# Altium schematic sheet Controller_Hardware_SDR_sch.SchDoc
size A4; SheetNumber: 5; SheetTotal: 5
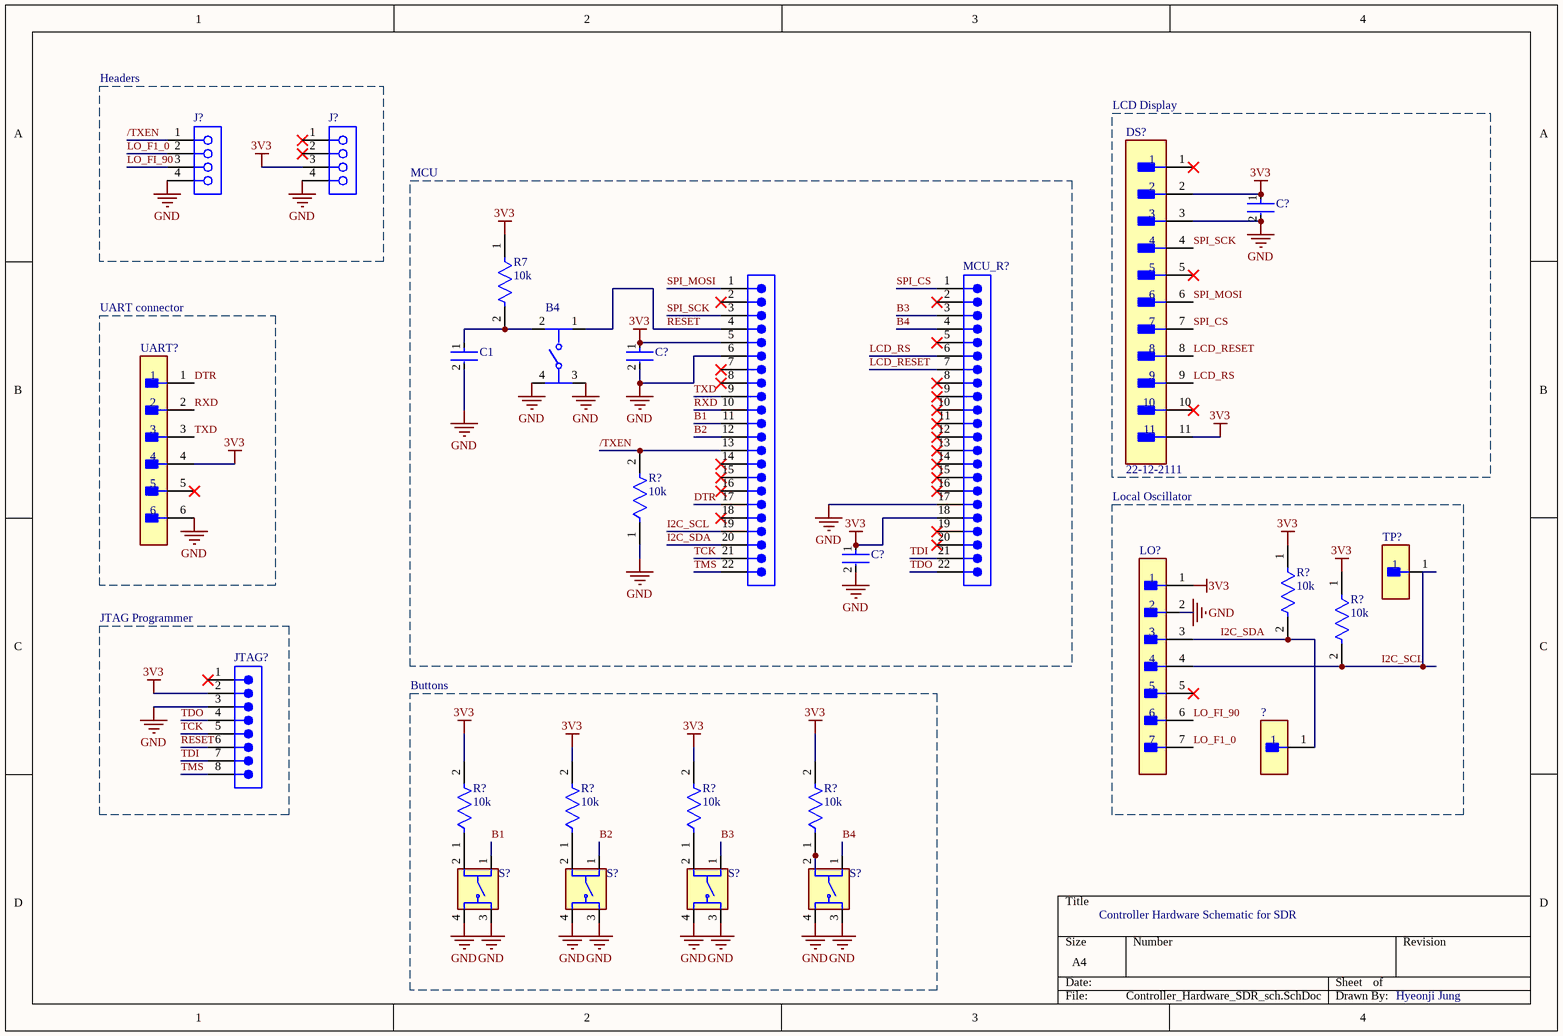
[diagram p0: Controller_Hardware_SDR_sch.SchDoc]

## Parts
(Parts that share a designator on the sheet are numbered #1, #2 ... from top to bottom, then left to right.)
?#1  (no value)  [61302211121]
?#2  5015  [FP-5015-MFG]  (value not drawn)
B4  FSM103  [FP-FSM103-MFG]  (value not drawn)
C1  100nF  [FP-0805-L_2_01_0_2-W_1_25-IPC_B]  (value not drawn)
C?#1  08051C104K4T2A  [FP-0805-L_2_01_0_2-W_1_25-IPC_B]  (value not drawn)
C?#2  08051C104K4T2A  [FP-0805-L_2_01_0_2-W_1_25-IPC_B]  (value not drawn)
C?#3  08051C104K4T2A  [FP-0805-L_2_01_0_2-W_1_25-IPC_B]  (value not drawn)
DS?  22-12-2111  [FP-22-12-2111-MFG]
J?#1  61300411821  [61300411821]  (value not drawn)
J?#2  61300411821  [61300411821]  (value not drawn)
JTAG?  61300811121  [61300811121]  (value not drawn)
LO?  70543-0006  [FP-70543-0006-MFG]  (value not drawn)
MCU_R?  61302211121  [61302211121]  (value not drawn)
R7  10k  [FP-MRS25-MFG]
R?#1  10k  [FP-RT0805-MFG]
R?#2  10k  [FP-MRS25-MFG]
R?#3  10k  [FP-MRS25-MFG]
R?#4  10k  [FP-RT0805-MFG]
R?#5  10k  [FP-RT0805-MFG]
R?#6  10k  [FP-RT0805-MFG]
R?#7  10k  [FP-RT0805-MFG]
S?#1  VS-1213-67-160GF  [SW_VS-1213-67-160GF]  (value not drawn)
S?#2  VS-1213-67-160GF  [SW_VS-1213-67-160GF]  (value not drawn)
S?#3  VS-1213-67-160GF  [SW_VS-1213-67-160GF]  (value not drawn)
S?#4  VS-1213-67-160GF  [SW_VS-1213-67-160GF]  (value not drawn)
TP?  0  [FP-5015-MFG]  (value not drawn)
UART?  22-28-4060  [FP-22-28-4060-MFG]  (value not drawn)

## Nets
3V3: ?#1.5 C?#1.1 C?#2.1 C?#3.1 DS?.2 DS?.11 J?#2.3 JTAG?.2 LO?.1 MCU_R?.18 R7.1 R?#2.1 R?#3.1 R?#4.2 R?#5.2 R?#6.2 R?#7.2 UART?.4
GND: ?#1.6 B4.3 B4.4 C1.2 C?#1.2 C?#2.2 C?#3.2 DS?.3 J?#1.4 J?#2.4 JTAG?.3 LO?.2 MCU_R?.17 R?#1.1 S?#1.3 S?#1.4 S?#2.3 S?#2.4 S?#3.3 S?#3.4 S?#4.3 S?#4.4 UART?.6
/TXEN: ?#1.13 J?#1.1 R?#1.2
B1: ?#1.11 S?#1.1
B2: ?#1.12 S?#2.1
B3: MCU_R?.3 S?#3.1
B4: MCU_R?.4 S?#4.1
DTR: ?#1.17 UART?.1
I2C_SCL: ?#1.19 LO?.4 R?#3.2 TP?.1
I2C_SDA: ?#1.20 ?#2.1 LO?.3 R?#2.2
LCD_RESET: DS?.8 MCU_R?.7
LCD_RS: DS?.9 MCU_R?.6
LO_F1_0: J?#1.2 LO?.7
LO_FI_90: J?#1.3 LO?.6
RESET: ?#1.4 B4.1 JTAG?.6
RXD: ?#1.10 UART?.2
SPI_CS: DS?.7 MCU_R?.1
SPI_MOSI: ?#1.1 DS?.6
SPI_SCK: ?#1.3 DS?.4
TCK: ?#1.21 JTAG?.5
TDI: JTAG?.7 MCU_R?.21
TDO: JTAG?.4 MCU_R?.22
TMS: ?#1.22 JTAG?.8
TXD: ?#1.9 UART?.3
NetB4_2: B4.2 C1.1 R7.2
NetR?#4_1: R?#4.1 S?#1.2
NetR?#5_1: R?#5.1 S?#2.2
NetR?#6_1: R?#6.1 S?#3.2
NetR?#7_1: R?#7.1 S?#4.2

Not connected (* = marked no-connect by the designer): ?#1 2* 7* 8* 14* 15* 16* 18*; DS? 1* 5* 10*; J?#2 1* 2*; JTAG? 1*; LO? 5*; MCU_R? 2* 5* 8* 9* 10* 11* 12* 13* 14* 15* 16* 19* 20*; UART? 5*

## Notes on the sheet
- Headers
- LCD Display
- MCU
- UART connector
- Local Oscillator
- JTAG Programmer
- Buttons
- Controller Hardware Schematic for SDR
- Hyeonji Jung

## Library data of the parts
?#1 MCU_R? = CMP-1502-01106-3: NexarPartId: 32855558; Number of Positions: 22; Connector Type: Male Pin; Contact Resistance: 20mΩ; Pitch: 2.54mm; Operating Supply Voltage: 250V; Current Rating: 3A; Gender: Male; Contact Plating: Gold; Number of Pins: 22; Mount: Through Hole; Color: Black; Number of Rows: 1; Contact Material: Copper; Contact Mating Length: 5.9944mm; Lead Pitch: 2.54mm; REACH SVHC: Unknown; Packaging: Bulk; Orientation: Vertical; Termination: Solder; Number of Contacts: 22; RoHS: Compliant
?#2 = CMP-2000-05183-2: PC TEST POINT MINIATURE; Manufacturer: keystone; Number Of Contacts: 1; Conn Orientation: Straight; Category: Conn; Manufacturer Part Number: 5015; Digikey Description: PC TEST POINT MINIATURE; Automotive: No; Lead Free: Yes; Octopart: https://octopart.com/5015-keystone-3822; ComponentLink2URL: http://www.keyelco.com/product-pdf.cfm?p=1353; Package: 5015; RoHS: TRUE; Device Class L3: unset; Device Class L2: unset; Contact Material: Silver; Device Class L1: Connectors; Height: 1.65mm; ComponentLink2Description: Datasheet
B4 = CMP-03407-000037-1: SWITCH TACTILE SPST-NO 0.05A 24V; Contact Resistance: 100mR; Actuator Length: 3.4mm; Switch Function: Off-Mom; Operating Force: 1.57N; Illumination Type: Non-Illuminated; Voltage Rating (DC): 12V; Current Rating: 50mA; Actuator Material: Polyester; Switch Travel: 0.3mm; Throw Configuration: SPST; Actuator Color: Black; Mechanical Life: 100000Cycles; Depth: 14.1mm; RoHS Compliant: Yes; Max Operating Temperature: 85°C; Mount: Through Hole; Min Operating Temperature: -35°C; Contact Plating: Silver; Width: 12mm; Package Quantity: 400; Radiation Hardening: No; Series: FSM100 ~ 104; Type: Switch; Termination: PC Pins; Voltage Rating: 24V; Contact Material: Brass; Max Voltage Rating (DC): 12V; Contact Current Rating: 50mA; Length: 12mm; Packaging: Loose Piece; Orientation: Straight; Max Current Rating: 50mA; Electrical Life: 100000Cycles
C1 C?#1-C?#3 = CMP-2007-04172-2: Automotive Ceramic Capacitor, 0805, 100nF, 10%, X7R, 15%, 100V; Voltage Rating (DC): 100V; Case Code (Metric): 2012; Mount: Surface Mount; Length: 2.01mm; Depth: 1.25mm; Lead Free: Lead Free; Ratings: AEC-Q200; Max Operating Temperature: 125°C; Tolerance: 10%; Case/Package: 0805; Width: 0.049inch; Package Quantity: 1; Thickness: 0.055inch; Construction: Flat; Min Operating Temperature: -55°C; REACH SVHC: No SVHC; Number of Pins: 2; Radiation Hardening: No; Capacitance: 100nF; Voltage Rating: 100V; Height: 1.4mm; Series: -; Voltage: 100V; Dielectric: X7R; Termination: SMD/SMT; Case Code (Imperial): 0805; RoHS Compliant: Yes; Packaging: Tape and Reel; Dielectric Material: Ceramic
DS? = CMP-04776-000920-1: KK 100 HDR FLAT RTAN 11 CKT GOLD; Contact Resistance: 10mR; Number of Contacts: 11; Connector Type: Male Pin; Current Rating: 4A; Voltage Rating: 250V; Color: White; Insulation Resistance: 50GR; Pitch: 2.54mm; Glow Wire Compliant: Non-compliant; Gender: Male; Contact Plating: Gold; Orientation: Right Angle; Radiation Hardening: No; Contact Mating Length: 0.369inch; Mount: Through Hole; Halogen Free: Low Halogen; Lead Free: Contains Lead; Number of Circuits: 11; Contact Type: Male Pin; Number of Positions: 11; Series: KK® 4094; RoHS Compliant: Yes; Termination: Solder; Package Quantity: 10; Packaging: Bulk; Number of Rows: 1; Min Operating Temperature: 0°C; Housing Material: Nylon; Housing Color: White; Voltage Rating (DC): 250V; Flammability Rating: UL94 V-0; Max Operating Temperature: 75°C; Contact Material: Brass
J?#1 J?#2 = CMP-1502-01316-3: NexarPartId: 61924712; Contact Resistance: 20mΩ; Gender: Female; Current Rating: 3A; Operating Supply Voltage: 250V; RoHS: Non-Compliant; Number of Pins: 4; Orientation: Vertical; Lead Pitch: 2.54mm
JTAG? = CMP-1502-01076-3: NexarPartId: 32855533; Connector Type: Male Pin; Number of Contacts: 8; Voltage Rating: 250V; Current Rating: 3A; Contact Resistance: 20mΩ; Pitch: 2.54mm; Gender: Male; Termination: Solder; Contact Material: Copper; Mount: Through Hole; Lead Pitch: 2.54mm; Number of Positions: 8; Operating Supply Voltage: 250V; Number of Pins: 8; Max Operating Temperature: 105°C; Height: 8.54mm; REACH SVHC: Unknown; Number of Rows: 1; Packaging: Bulk; Contact Plating: Gold; Contact Mating Length: 5.9944mm; Orientation: Vertical; RoHS: Compliant; Color: Black; Min Operating Temperature: -40°C
LO? = CMP-04776-000019-1: CONN HEADER VERT 7POS 2.54MM; Manufacturer: Molex; Voltage Rating: 250V; Number Of Contacts: 7; Conn Gender: Male; Standoff Height: 0.25mm; Current Rating: 3A; Conn Orientation: Vertical; Category: Conn; RoHS: TRUE; Contact Material: Gold,Nickel; Device Class L2: Headers and Wire Housings; Octopart: https://octopart.com/70543-0006-molex-277837; Mouser Description: Conn Shrouded Header (4 Sides) HDR 7 POS 2.54mm Solder ST Thru-Hole SL™ Tube; Device Class L1: Connectors; Lead Free: Yes; Temperature Range Low: -40°C; Digikey Description: CONN HEADER VERT 7POS 2.54MM; Number Of Rows: 1; Package: 0; Temperature: -40°C to +105°C; Device Class L3: unset; Height: 12.07mm; Pitch: 2.54mm; Temperature Range High: +105°C; ComponentLink2Description: Datasheet; Automotive: No; Footprint Url: https://www.molex.com/pdm_docs/sd/705430006_sd.pdf; Manufacturer Part Number: 70543-0006; ComponentLink2URL: https://www.molex.com/webdocs/datasheets/pdf/en-us/0705430006_PCB_HEADERS.pdf
R7 R?#2 R?#3 = CMP-00030-42632392-1: MRS25000C1002FCT00 Resistor, 10 kOhm, ± 1%, 600 mW, Axial Leaded, Metal Film (Thin Film), Professional; Power Rating: 600mW; Voltage Rating (DC): 350V; Lead Length: 26mm; Resistance: 10kΩ; Temperature Coefficient: 50ppm/°C; Termination: Axial; Number of Terminations: 2; Diameter: 2.5mm; Composition: Metal Film, Thin Film; Number of Pins: 2; Length: 6.5mm; Military Standard: Not; RoHS: Compliant; NexarPartId: 42632392; Width: 2.5mm; Radiation Hardening: No; Voltage Rating: 350V; Max Power Dissipation: 600mW; Min Operating Temperature: -55°C; Lead Free: Lead Free; Max Operating Temperature: 155°C; Tolerance: 1%; Schedule B: 8533210090, 8533210090; Contact Plating: Tin; Mount: Through Hole; REACH SVHC: Unknown; Case/Package: Conformal
R?#1 R?#4-R?#7 = CMP-03412-023097-1: RES 10.0K OHM 1/8W 1% SMD 0805; Manufacturer Part Number: RT0805FRE0710KL; Manufacturer: Yageo; Value: 10KΩ; Tolerance: 0.0001; Temperature Coefficient: 50 ppm/°C; Power Rating: 0.125W; Voltage Rating: 150V; ComponentLink2Description: Datasheet; Temperature: -55°C to +155°C; Digikey Description: RES 10.0K OHM 1/8W 1% SMD 0805; Automotive: No; Octopart: https://octopart.com/rt0805fre0710kl-yageo-40301150; Composition: Thin Film; Resistance: 10KΩ; RoHS: TRUE; Category: Res; Device Class L2: Resistors; Package: RT0805; ComponentLink2URL: http://www.yageo.com/documents/recent/PYu-RT_1-to-0.01_RoHS_L_9.pdf; Ipc Land Pattern Name: RESC200125X50; Height: 0.6mm; Footprint Url: http://www.yageo.com/exep/pages/download/literatures/PYu-R_Mount_10.pdf; Device Class L3: Chip SMD Resistors; Temperature Range High: +155°C; Lead Free: Yes; Mouser Description: Thin Film Resistors 1/8W 10K ohm 1% 50ppm; Temperature Range Low: -55°C; Series: RT; Device Class L1: Passive Components
S?#1-S?#4 = VS-1213-67-160GF: Flat Type PCB Mount 12 x 12mm Tact Switches; MP: VS-1213-67-160GF; Value: *; Availability: Unavailable; Package: None; Price: None
TP? = CMP-2000-05183-2: PC TEST POINT MINIATURE; Manufacturer Part Number: 5015; Manufacturer: keystone; Number Of Contacts: 1; Conn Orientation: Straight; Category: Conn; Digikey Description: PC TEST POINT MINIATURE; Automotive: No; Lead Free: Yes; Octopart: https://octopart.com/5015-keystone-3822; ComponentLink2URL: http://www.keyelco.com/product-pdf.cfm?p=1353; Package: 5015; RoHS: TRUE; Device Class L3: unset; Device Class L2: unset; Contact Material: Silver; Device Class L1: Connectors; Height: 1.65mm; ComponentLink2Description: Datasheet
UART? = CMP-04776-000763-1: CONN HEADER VERT 6POS 2.54MM; Voltage Rating: 250V; Current Rating: 4A; Number of Contacts: 6; Max Voltage Rating (DC): 250.25kV; Gender: Male; Contact Resistance: 20mR; Connector Type: Male Pin; Color: Black; Max Voltage Rating (AC): 250V; Pitch: 2.54mm; Orientation: Straight; Max Operating Temperature: 75°C; Contact Plating: Tin; Depth: 2.49mm; Contact Type: Male Pin; Number of Positions: 6; Length: 15.24mm; Packaging: Bulk; Mount: Through Hole; Housing Material: Thermoplastic; Housing Color: Black; Termination: Solder; Contact Material: Brass; Min Operating Temperature: 0°C; Series: KK® 42375; Number of Rows: 1; Package Quantity: 1; RoHS Compliant: Yes; Contact Mating Length: 0.24inch